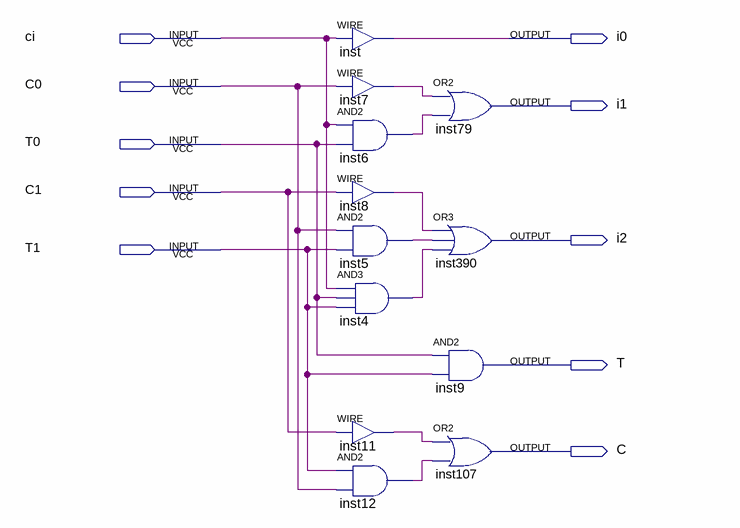
[diagram p0: schematic sheet]
// Quartus schematic ncarry.bdf as structural Verilog: 12 symbols, 10 pins
module ncarry (
  input  ci,
  input  C0,
  input  T0,
  input  C1,
  input  T1,
  output i0,
  output i1,
  output i2,
  output T,
  output C
);

  wire inst4_out, inst5_out, inst6_out, inst7_out, inst8_out, inst11_out, inst12_out;

  assign i0 = ci;  // WIRE inst
  assign inst7_out = C0;  // WIRE inst7
  and inst6 (inst6_out, ci, T0);
  assign inst8_out = C1;  // WIRE inst8
  and inst5 (inst5_out, C0, T1);
  and inst4 (inst4_out, ci, T0, T1);
  assign inst11_out = C1;  // WIRE inst11
  and inst12 (inst12_out, T1, C0);
  or inst79 (i1, inst7_out, inst6_out);
  or inst390 (i2, inst8_out, inst5_out, inst4_out);
  and inst9 (T, T0, T1);
  or inst107 (C, inst11_out, inst12_out);
endmodule
